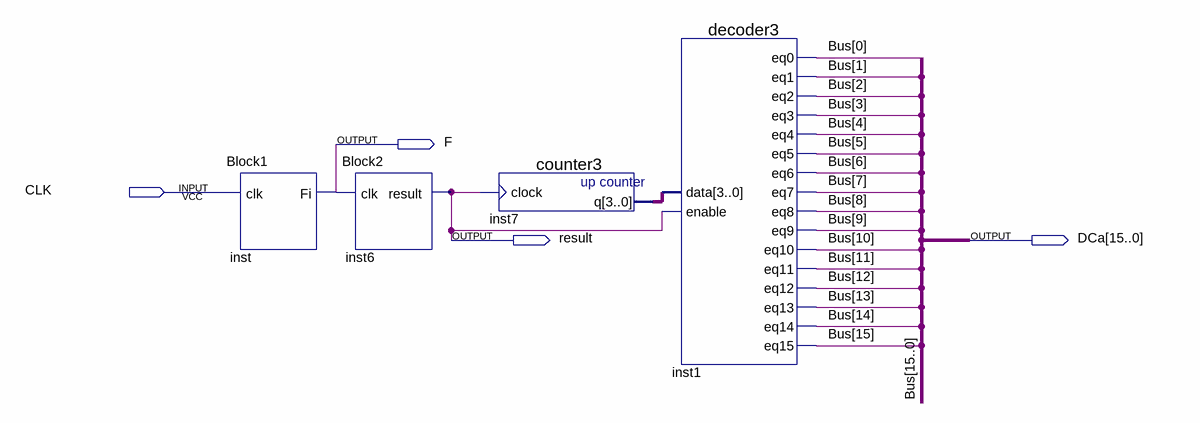
[diagram p0: schematic sheet]
// Quartus schematic Block3.bdf as structural Verilog: 4 symbols, 4 pins
module Block3 (
  input  CLK,
  output F,
  output result,
  output [15:0] DCa
);

  wire [3:0] inst7_q;

  Block1 inst (.clk(CLK), .Fi(F));
  Block2 inst6 (.clk(F), .result(result));
  counter3 inst7 (.clock(result), .q(inst7_q));
  decoder3 inst1 (
    .data(inst7_q), .enable(result), .eq0(DCa[0]), .eq1(DCa[1]), .eq2(DCa[2]), .eq3(DCa[3]), .eq4(DCa[4]),
    .eq5(DCa[5]), .eq6(DCa[6]), .eq7(DCa[7]), .eq8(DCa[8]), .eq9(DCa[9]), .eq10(DCa[10]), .eq11(DCa[11]),
    .eq12(DCa[12]), .eq13(DCa[13]), .eq14(DCa[14]), .eq15(DCa[15]));

  // Other names for the same wires on the sheet: Bus[15:0] = DCa
endmodule
